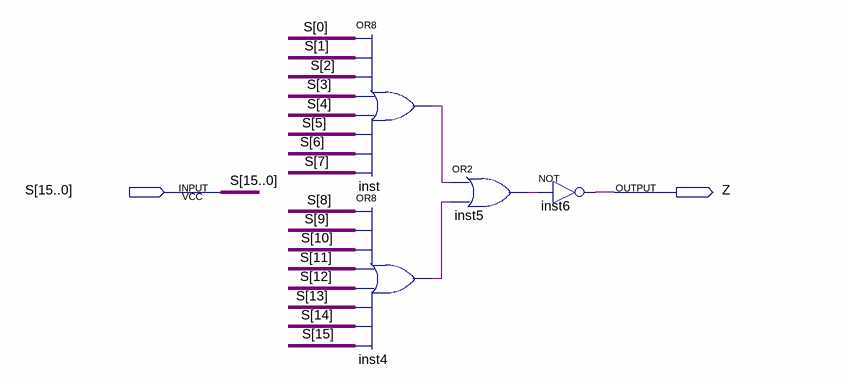
[diagram p0: schematic sheet]
// Quartus schematic 10Lab_16_1_or.bdf as structural Verilog: 4 symbols, 2 pins
module \10Lab_16_1_or  (
  input  [15:0] S,
  output Z
);

  wire inst4_out, inst5_out, inst_out;

  or inst (inst_out, S[0], S[1], S[2], S[3], S[4], S[5], S[6], S[7]);
  or inst4 (inst4_out, S[8], S[9], S[10], S[11], S[12], S[13], S[14], S[15]);
  or inst5 (inst5_out, inst_out, inst4_out);
  not inst6 (Z, inst5_out);
endmodule
